# EAGLE design main (EAGLE 6.1)
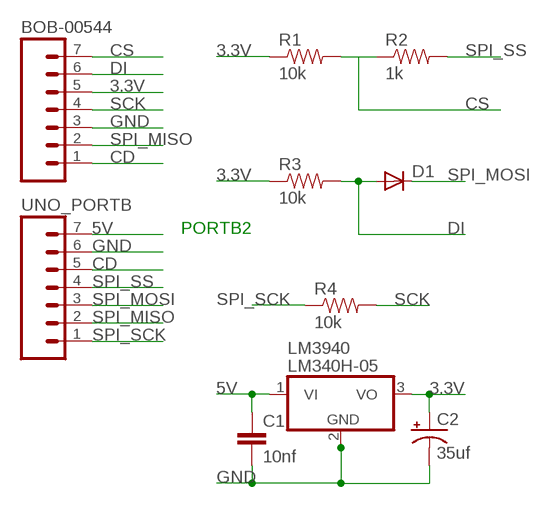
[diagram p0: schematic, sheet 1]

## Parts
BOB-00544  M07  [1X07]
C1  10nf  CAPPTH  [CAP-PTH-SMALL]
C2  35uf  CAP_POLPTH1  [CPOL-RADIAL-100UF-25V]
D1  DIODE1N4148  [DIODE-1N4148]
LM3940  LM340H-05  [TO220H]
R1  10k  RESISTORPTH-1/4W  [AXIAL-0.4]
R2  1k  RESISTORPTH-1/4W  [AXIAL-0.4]
R3  10k  RESISTORPTH-1/4W  [AXIAL-0.4]
R4  10k  RESISTORPTH-1/4W  [AXIAL-0.4]
UNO_PORTB  M07  [1X07]

## Nets
3.3V: BOB-00544.5 C2.1(+) LM3940.3(VO) R1.P$1 R3.P$1
5V: C1.1 LM3940.1(VI) UNO_PORTB.7
CD: BOB-00544.1 UNO_PORTB.5
CS: BOB-00544.7 R1.P$2 R2.P$1
DI: BOB-00544.6 D1.A R3.P$2
GND: BOB-00544.3 C1.2 C2.2(-) LM3940.2(GND) UNO_PORTB.6
SCK: BOB-00544.4 R4.P$2
SPI_MISO: BOB-00544.2 UNO_PORTB.2
SPI_MOSI: D1.C UNO_PORTB.3
SPI_SCK: R4.P$1 UNO_PORTB.1
SPI_SS: R2.P$2 UNO_PORTB.4

## Notes on the sheet
- PORTB2

## Library data of the parts
BOB-00544 UNO_PORTB = SparkFun:M07: Header 7 Standard 7-pin 0.1" header. Use with straight break away headers (SKU : PRT-00116), right angle break away headers (PRT-00553), swiss pins (PRT-00743), machine pins (PRT-00117), and female headers (PRT-00115). NOTES ON THE VARIANTS LOCK and LOCK_LONGPADS... This footprint was designed to help hold the alignment of a through-hole component (i.e. 7-pin header) while soldering it into place. You may notice that each hole has been shifted either up or down by 0.005 of an inch from it's more standard position (which is usually a perfectly straight line). This slight alteration caused the pins (the squares in the middle) to touch the edges of the holes. Because they are alternating, it causes a "brace" to hold the header in place. 0.005 has proven to be the perfect amount of "off-center" position when using our standard breakaway headers. Although looks a little odd when you look at the bare footprint, once you have a header in there, the alteration is very hard to notice. Also, if you push a header all the way into place, it is covered up entirely on the bottom side. This idea of altering the position of holes to aid alignment will be further integrated into the Sparkfun Library for other footprints. It can help hold any component with 3 or more connection pins.
C1 = SparkFun:CAP: Capacitor Standard 0603 ceramic capacitor, and 0.1" leaded capacitor.
C2 = SparkFun:CAP_POL: Capacitor Polarized These are standard SMD and PTH capacitors. Normally 10uF, 47uF, and 100uF in electrolytic and tantalum varieties. Always verify the external diameter of the through hole cap, it varies with capacity, voltage, and manufacturer. The EIA devices should be standard.
D1 = SparkFun:DIODE: Diode These are standard reverse protection diodes and small signal diodes. SMA package can handle up to about 1A. SOD-323 can handle about 200mA. What the SOD-323 package when ordering, there are some mfgs out there that are 5-pin packages.
LM3940 = linear:LM340?-*: Positive VOLTAGE REGULATOR Source: http://cache.national.com/ds/LM/LM340.pdf
R1-R4 = SparkFun:RESISTOR: Resistor Basic schematic elements and footprints for 0603, 1206, and PTH resistors.

## Board
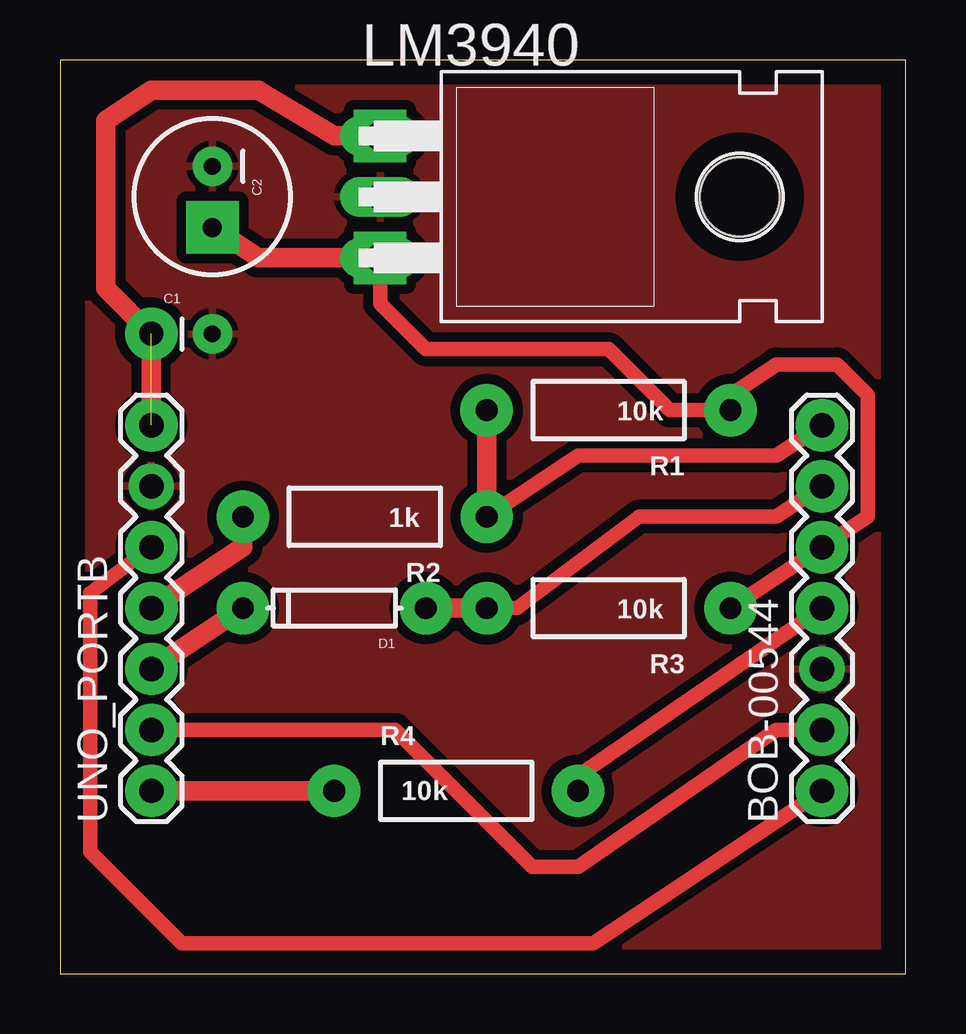
[diagram p1: board, top side]

Size 35.23 x 38.09 mm. Coordinates in mm from the lower left corner, seen from the top.
Outline: 0,0 35.23,0 35.23,38.09 0,38.09 0,0
Copper layers (1*16): Top 0.035mm / dielectric 1.5mm / Bottom 0.035mm
Design rules: minimum track width 10mil, minimum drill 24mil, track to track 8mil, track to pad 8mil, pad to pad 8mil, via to via 8mil, smd to smd 8mil, copper to edge 40mil, drill to drill 8mil, minimum pad ring 10mil, minimum via ring 8mil, stop-mask expansion 4mil, vias tented up to drill 0mil, thermal gap 10mil

### Footprints (pad centres in the part's own frame; a part is rotated, then mirrored left to right if it is on the bottom)
1X07 = drill 1.016 pad 1.88: 1 0,0; 2 2.54,0; 3 5.08,0; 4 7.62,0; 5 10.16,0; 6 12.7,0; 7 15.24,0
CAP-PTH-SMALL = drill 0.7 pad 1.651: 1 0,0; 2 2.54,0
CPOL-RADIAL-100UF-25V = drill 0.7 pad 1.651 square: 1 1.27,0 | drill 0.7 pad 1.651: 2 -1.27,0
DIODE-1N4148 = drill 0.9 pad 1.88: A -3.81,0; C 3.81,0
TO220H = drill 1.118 long: 1 -2.54,-10.16; 2 0,-10.16; 3 2.54,-10.16 | hole 3.302: 0,4.826
AXIAL-0.4 = drill 0.9 pad 1.88: P$1 -5.08,0; P$2 5.08,0

### Placement (x,y rotation side)
BOB-00544  31.75,7.62 90 top
C1  3.81,26.67 0 top
C2  6.35,32.38 270 top
D1  11.43,15.24 180 top
LM3940  23.5,32.38 270 top
R1  22.86,23.49 180 top
R2  12.7,19.05 180 top
R3  22.86,15.24 180 top
R4  16.51,7.62 0 top
UNO_PORTB  3.81,7.62 90 top

### Tracks (layer width: path | path; a pad name or v marks a point on that pad's centre or on a via)
3.3V
  Top 0.61: LM3940.3 13.33,27.94 15.24,26.03 22.86,26.03 25.4,23.49 R1.P$1 27.94,24.13 29.84,25.4 32.38,25.4 33.66,24.13 33.66,19.05 BOB-00544.5 R3.P$1
  Top 0.813: C2.1 8.26,29.84 LM3940.3
5V
  Top 0.813: LM3940.1 11.43,34.92 8.26,36.83 3.81,36.83 1.91,35.56 1.91,28.58 C1.1 UNO_PORTB.7
CD
  Top 0.61: UNO_PORTB.5 1.27,15.88 1.27,5.08 5.08,1.27 22.22,1.27 BOB-00544.1
CS
  Top 0.61: BOB-00544.7 29.84,21.59 21.59,21.59 R2.P$1
  Top 0.813: R1.P$2 R2.P$1
DI
  Top 0.61: BOB-00544.6 29.84,19.05 24.13,19.05 19.05,15.24 R3.P$2
  Top 0.813: D1.A R3.P$2
GND
  pour Top (isolate 0.406): -0.35,38.03 35.56,38.1 35.56,0 -0.35,-0.07
N$1  (via drill 1.2 pad 2.18)
  other vias: 13.34,34.92
N$2  (via drill 0.8 pad 2.18)
  other vias: 6.35,31.11
N$3  (via drill 1.2 pad 2.18)
  other vias: 13.33,29.83
N$4  (via drill 0.9 pad 2.18)
  other vias: 17.78,23.49
N$5  (via drill 0.9 pad 2.18)
  other vias: 17.78,19.05
N$6  (via drill 0.9 pad 2.18)
  other vias: 15.24,15.24
N$7  (via drill 0.9 pad 2.18)
  other vias: 17.78,15.23
N$8  (via drill 0.9 pad 2.18)
  other vias: 7.62,19.05
N$9  (via drill 0.9 pad 2.18)
  other vias: 7.62,15.24
N$10  (via drill 0.9 pad 2.18)
  other vias: 11.42,7.62
N$11  (via drill 0.9 pad 2.18)
  other vias: 21.58,7.62
N$12  (via drill 0.9 pad 2.18)
  other vias: 27.93,15.24
N$13  (via drill 0.9 pad 2.18)
  other vias: 27.94,23.49
N$14  (via drill 1 pad 2.18)  (1 unrouted)
  other vias: 3.81,22.86 3.81,26.67
N$16  (via drill 1 pad 2.18)
  other vias: 3.81,17.78
N$17  (via drill 1 pad 2.18)
  other vias: 3.81,15.24
N$18  (via drill 1 pad 2.18)
  other vias: 3.81,12.7
N$19  (via drill 1 pad 2.18)
  other vias: 3.81,10.16
N$20  (via drill 1 pad 2.18)
  other vias: 3.81,7.62
N$21  (via drill 1 pad 2.18)
  other vias: 31.75,22.86
N$22  (via drill 1 pad 2.18)
  other vias: 31.75,20.32
N$24  (via drill 1 pad 2.18)
  other vias: 31.75,17.78
N$25  (via drill 1 pad 2.18)
  other vias: 31.76,15.24
N$26  (via drill 1 pad 2.18)
  other vias: 31.75,10.16
N$27  (via drill 1 pad 2.18)
  other vias: 31.75,7.62
SCK
  Top 0.61: BOB-00544.4 21.59,8.25 R4.P$2
SPI_MISO
  Top 0.61: UNO_PORTB.2 13.97,10.16 19.68,4.45 21.59,4.45 29.84,10.16 BOB-00544.2
SPI_MOSI
  Top 0.813: UNO_PORTB.3 D1.C
SPI_SCK
  Top 0.813: UNO_PORTB.1 R4.P$1
SPI_SS
  Top 0.813: R2.P$2 7.62,17.78 UNO_PORTB.4